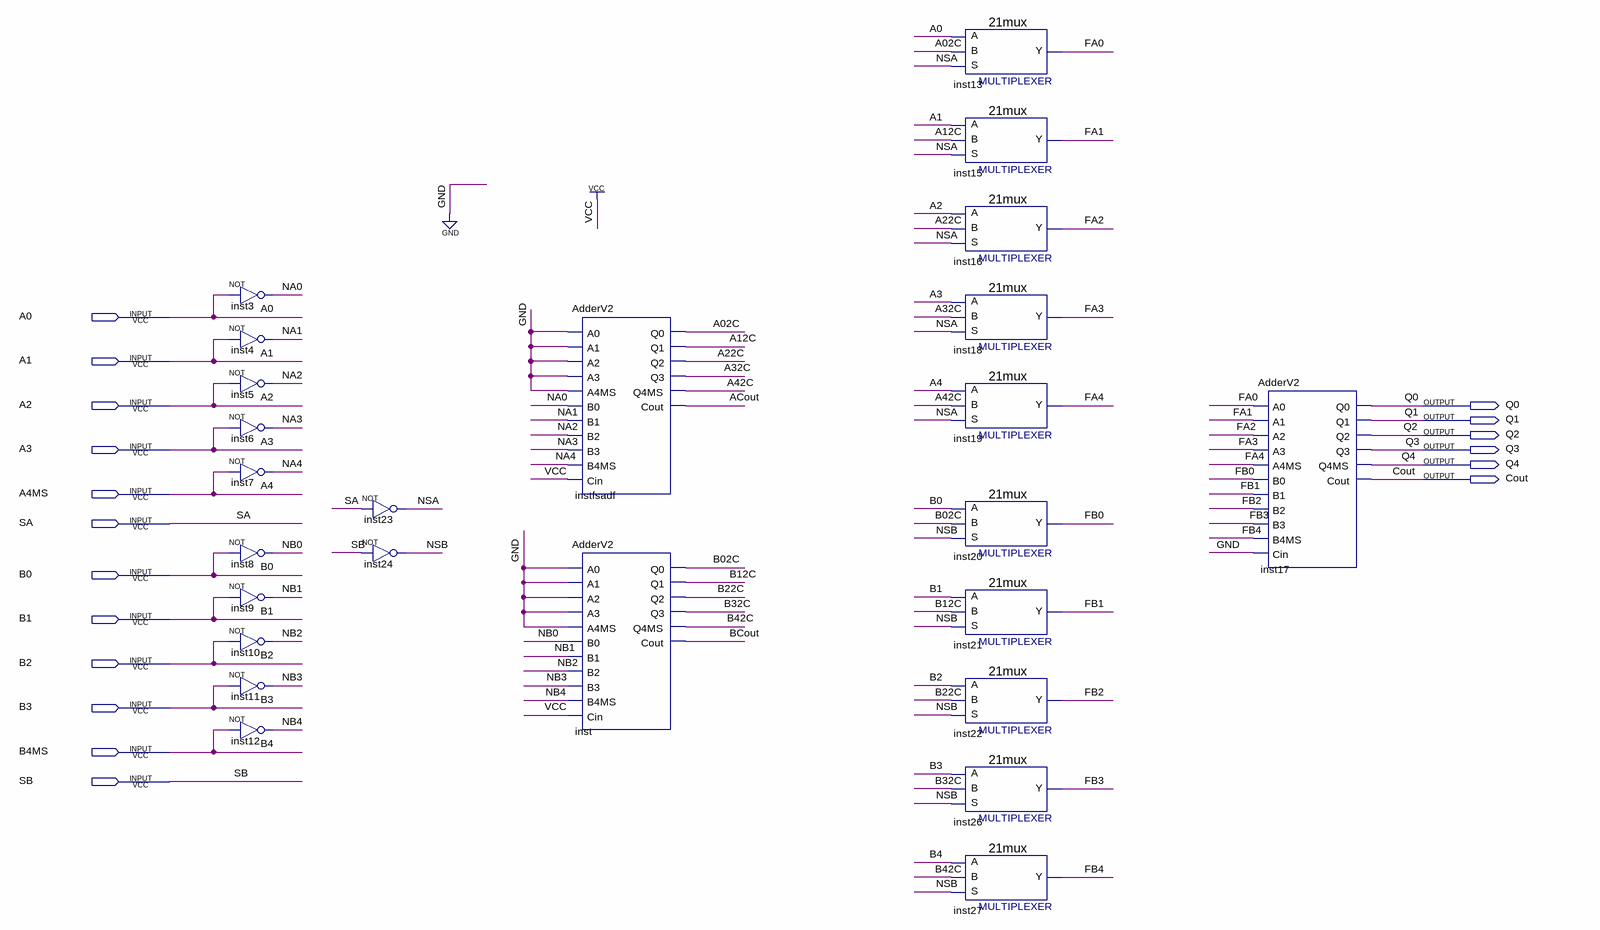
[diagram p0: schematic sheet]
// Quartus schematic AdderSubtracterV2.bdf as structural Verilog: 25 symbols, 18 pins
module AdderSubtracterV2 (
  input  A0,
  input  A1,
  input  A2,
  input  A3,
  input  A4MS,
  input  SA,
  input  B0,
  input  B1,
  input  B2,
  input  B3,
  input  B4MS,
  input  SB,
  output Q0,
  output Q1,
  output Q2,
  output Q3,
  output Q4,
  output Cout
);

  wire A02C, A12C, A22C, A32C, A42C, ACout, B02C, B12C, B22C, B32C, B42C, BCout, FA0, FA1, FA2, FA3, FA4,
       FB0, FB1, FB2, FB3, FB4, NA0, NA1, NA2, NA3, NA4, NB0, NB1, NB2, NB3, NB4, NSA, NSB;

  not inst3 (NA0, A0);
  not inst4 (NA1, A1);
  not inst5 (NA2, A2);
  not inst6 (NA3, A3);
  not inst7 (NA4, A4MS);
  not inst8 (NB0, B0);
  not inst9 (NB1, B1);
  not inst10 (NB2, B2);
  not inst11 (NB3, B3);
  not inst12 (NB4, B4MS);
  not inst23 (NSA, SA);
  not inst24 (NSB, SB);
  AdderV2 instfsadf (
    .A0(1'b0), .A1(1'b0), .A2(1'b0), .A3(1'b0), .A4MS(1'b0), .B0(NA0), .B1(NA1), .B2(NA2), .B3(NA3),
    .B4MS(NA4), .Cin(1'b1), .Q0(A02C), .Q1(A12C), .Q2(A22C), .Q3(A32C), .Q4MS(A42C), .Cout(ACout));
  AdderV2 inst (
    .A0(1'b0), .A1(1'b0), .A2(1'b0), .A3(1'b0), .A4MS(1'b0), .B0(NB0), .B1(NB1), .B2(NB2), .B3(NB3),
    .B4MS(NB4), .Cin(1'b1), .Q0(B02C), .Q1(B12C), .Q2(B22C), .Q3(B32C), .Q4MS(B42C), .Cout(BCout));
  \21mux  inst13 (.S(NSA), .B(A02C), .A(A0), .Y(FA0));
  \21mux  inst15 (.S(NSA), .B(A12C), .A(A1), .Y(FA1));
  \21mux  inst16 (.S(NSA), .B(A22C), .A(A2), .Y(FA2));
  \21mux  inst18 (.S(NSA), .B(A32C), .A(A3), .Y(FA3));
  \21mux  inst19 (.S(NSA), .B(A42C), .A(A4MS), .Y(FA4));
  \21mux  inst20 (.S(NSB), .B(B02C), .A(B0), .Y(FB0));
  \21mux  inst21 (.S(NSB), .B(B12C), .A(B1), .Y(FB1));
  \21mux  inst22 (.S(NSB), .B(B22C), .A(B2), .Y(FB2));
  \21mux  inst26 (.S(NSB), .B(B32C), .A(B3), .Y(FB3));
  \21mux  inst27 (.S(NSB), .B(B42C), .A(B4MS), .Y(FB4));
  AdderV2 inst17 (
    .A0(FA0), .A1(FA1), .A2(FA2), .A3(FA3), .A4MS(FA4), .B0(FB0), .B1(FB1), .B2(FB2), .B3(FB3), .B4MS(FB4),
    .Cin(1'b0), .Q0(Q0), .Q1(Q1), .Q2(Q2), .Q3(Q3), .Q4MS(Q4), .Cout(Cout));

  // Other names for the same wires on the sheet: A4 = A4MS; B4 = B4MS
endmodule
